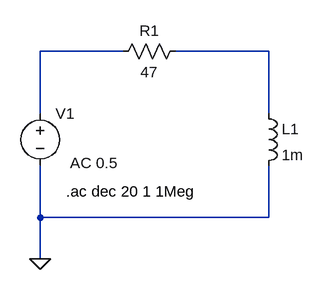
[diagram p0: schematic aufgabe2_hochpass.asc]
aufgabe2_hochpass.asc, the LTspice schematic file:
Version 4
SHEET 1 880 680
WIRE 176 48 48 48
WIRE 400 48 256 48
WIRE 48 144 48 48
WIRE 400 144 400 48
WIRE 48 304 48 224
WIRE 400 304 400 224
WIRE 400 304 48 304
WIRE 48 368 48 304
FLAG 48 368 0
SYMBOL voltage 48 128 R0
WINDOW 123 46 92 Left 2
WINDOW 39 0 0 Left 2
WINDOW 3 46 64 Left 2
SYMATTR Value2 AC 0.5
SYMATTR InstName V1
SYMATTR Value ""
SYMBOL res 272 32 R90
WINDOW 0 0 56 VBottom 2
WINDOW 3 32 56 VTop 2
SYMATTR InstName R1
SYMATTR Value 47
SYMBOL ind 384 128 R0
SYMATTR InstName L1
SYMATTR Value 1m
SYMATTR SpiceLine Rser=1.2
TEXT 88 264 Left 2 !.ac dec 20 1 1Meg

The netlist it stands for:
* aufgabe2_hochpass.asc
V1 N001 0 AC 0.5
R1 N002 N001 47
L1 N002 0 1m Rser=1.2
.ac dec 20 1 1Meg
.backanno
.end